# Altium project LimeSDR-Micro_1v1.PrjPcb (part 2 of 4)
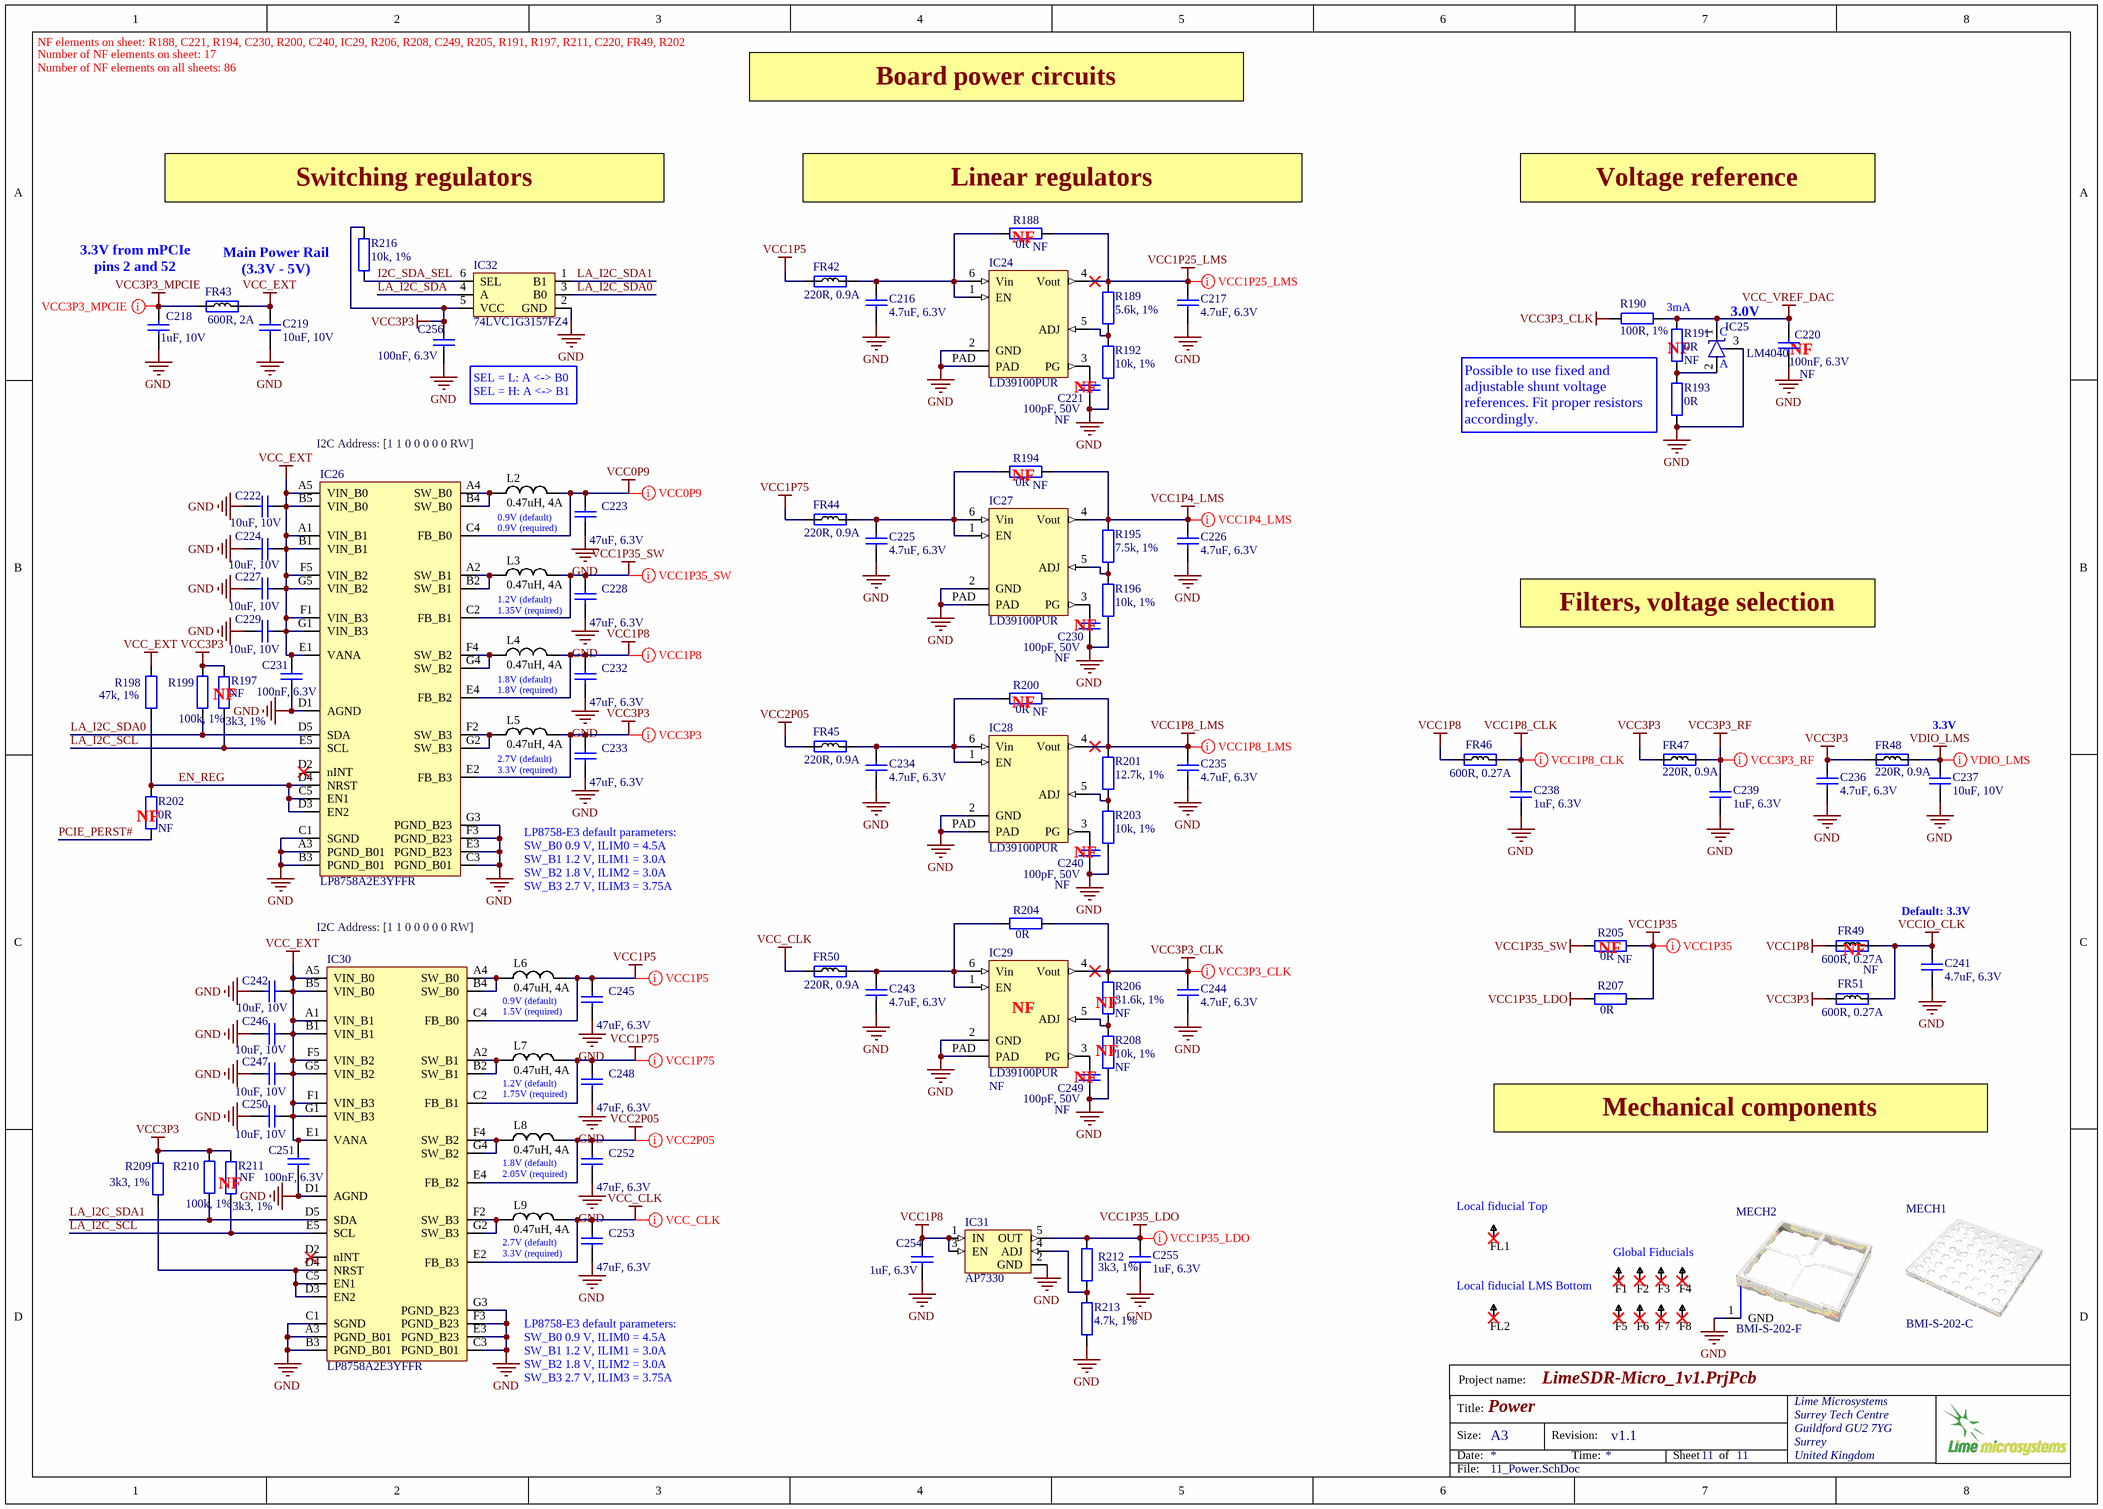
[diagram p3: 11_Power.SchDoc]

## Sheet 11_Power.SchDoc: Power (continued)

### Layout directives
net class VCC1P25_LMS: VCC1P25_LMS
net class VCC1P4_LMS: VCC1P4_LMS
net class VCC1P8_LMS: VCC1P8_LMS
net class VCC3P3_CLK: VCC3P3_CLK
net class VCC1P5: VCC1P5
net class VCC0P9: VCC0P9
net class VCC3P3_MPCIE: VCC3P3_MPCIE
net class VCC1P35_SW: VCC1P35_SW
net class VCC1P8: VCC1P8
net class VCC3P3: VCC3P3
net class VCC1P75: VCC1P75
net class VCC2P5: VCC2P05
net class VCC_CLK: VCC_CLK
net class VCC1P35_LDO: VCC1P35_LDO
net class VDIO_LMS: VDIO_LMS
net class VCC1P35: VCC1P35
net class VCC3P3_RF: VCC3P3_RF
net class VCC1P8_CLK: VCC1P8_CLK

### Notes on the sheet
- NF elements on sheet: R188, C221, R194, C230, R200, C240, IC29, R206, R208, C249, R205, R191, R197, R211, C220, FR49, R202
- Number of NF elements on sheet: 17
- Number of NF elements on all sheets: 86
- Board power circuits
- (near R216) Switching regulators
- (near R188) Linear regulators
- (near R188) NF
- Voltage reference
- 3.3V from mPCIe pins 2 and 52
- Main Power Rail
  (3.3V - 5V)
- 3mA
- 3.0V
- (near R191) NF
- (near IC25) A
- (near IC25) C
- (near C220) NF
- I2C Address: [1 1 0 0 0 0 0 RW]
- (near C256) SEL = L: A <-> B0
  SEL = H: A <-> B1
- NF
- Possible to use fixed and adjustable shunt voltage references. Fit proper resistors accordingly.
- (near R194) NF
- 0.9V (default)
  0.9V (required)
- 1.2V (default)
  1.35V (required)
- Filters, voltage selection
- (near R197) NF
- 1.8V (default)
  1.8V (required)
- (near R200) NF
- 2.7V (default)
  3.3V (required)
- 3.3V
- (near R202) NF
- LP8758-E3 default parameters:
  SW_B0 0.9 V, ILIM0 = 4.5A
  SW_B1 1.2 V, ILIM1 = 3.0A
  SW_B2 1.8 V, ILIM2 = 3.0A
  SW_B3 2.7 V, ILIM3 = 3.75A
- Default: 3.3V
- (near R205) NF
- (near FR49) NF
- 0.9V (default)
  1.5V (required)
- (near IC29) NF
- (near R208) NF
- (near R206) NF
- 1.2V (default)
  1.75V (required)
- Mechanical components
- 1.8V (default)
  2.05V (required)
- (near FL1) Local fiducial Top
- Global Fiducials
- Local fiducial LMS Bottom
- Project name:
- Title:
- Size:
- Date:
- A3
- Revision:
- Time:
- Sheet
- of
- File: